# Altium project LED_Nixie_Display.PrjPcb
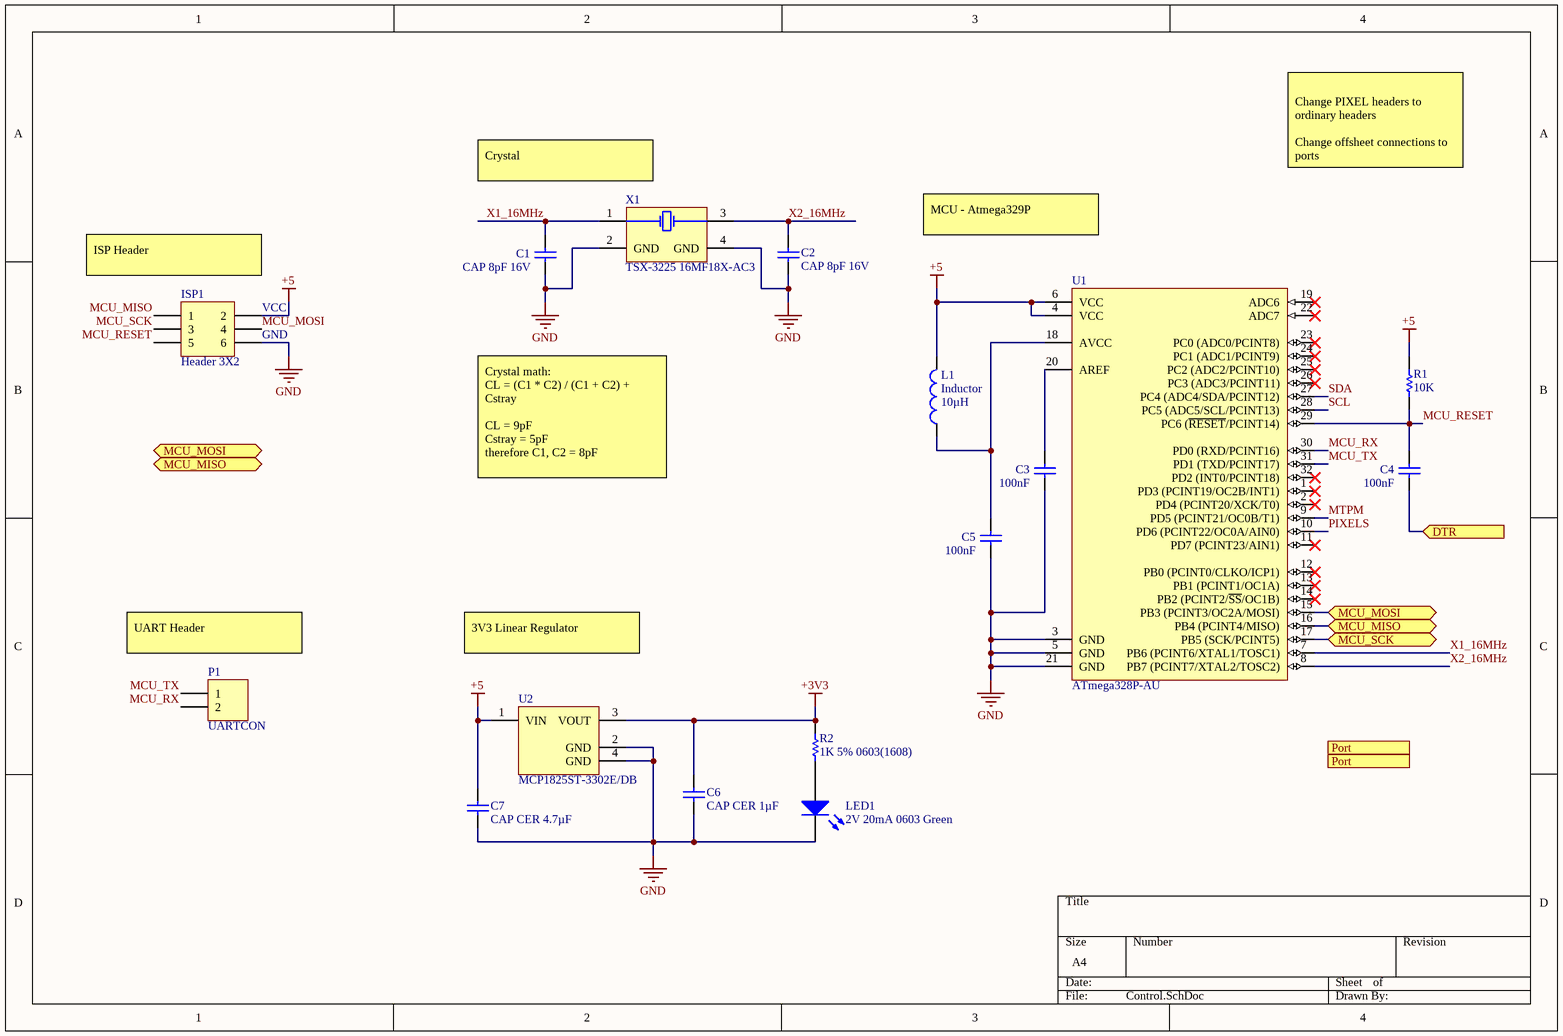
[diagram p0: Control.SchDoc]
5 sheets, 67 parts. Net scope: flat (ports and power ports of the same name join across sheets).
Board files: MasterBoard.PcbDoc, PCB1.PcbDoc
Sheets:
  Control.SchDoc
  LEDs.SchDoc
  RTC.SchDoc
  USB.SchDoc
  Touch.SchDoc

## Sheet Control.SchDoc
size A4

### Parts
C1  CAP 8pF 16V  [CAPC0603(1608)100_N]
C2  CAP 8pF 16V  [CAPC0603(1608)100_N]
C3  100nF  [CAPC0603(1608)100_M]
C4  100nF  [CAPC0603(1608)100_M]
C5  100nF  [CAPC0603(1608)100_M]
C6  CAP CER 1µF  [CAPC1608X90X20LL10]
C7  CAP CER 4.7µF  [CAPC1608X90X35NL10T15]
ISP1  Header 3X2  [HDR2X3]
L1  Inductor  value 10µH  [0603]
LED1  2V 20mA 0603 Green  [0603_A]
P1  UARTCON  [HDR1X2]
R1  10K  [RESC0603(1608)_N]
R2  1K 5% 0603(1608)  [RESC0603(1608)_L]
U1  ATmega328P-AU  [32A_M]
U2  MCP1825ST-3302E/DB  [SOT-223-DB3_L]
X1  TSX-3225 16MF18X-AC3  [EPSON-TSX-3225_V]

### Ports
DTR (in), MCU_MISO (bidir), MCU_MOSI (bidir), MCU_SCK (bidir), Port

### Nets
+3V3: C6.2 R2.2 U2.3(VOUT)
+5: C7.2 ISP1.2 L1.2 R1.2 U1.4(VCC) U1.6(VCC) U2.1(VIN)
GND: C1.1 C2.2 C3.1 C5.1 C6.1 C7.1 ISP1.6 LED1.1(K) U1.3(GND) U1.5(GND) U1.21(GND) U2.2(GND) U2.4(GND) X1.2(GND) X1.4(GND)
MCU_MISO: ISP1.1
MCU_MOSI: ISP1.4
MCU_RESET: C4.2 ISP1.5 R1.1 U1.29(PC6_(~{RESET}/PCINT14))
MCU_RX: P1.2 U1.30(PD0_(RXD/PCINT16))
MCU_SCK: ISP1.3
MCU_TX: P1.1 U1.31(PD1_(TXD/PCINT17))
MTPM: U1.9(PD5_(PCINT21/OC0B/T1))
PIXELS: U1.10(PD6_(PCINT22/OC0A/AIN0))
SCL: U1.28(PC5_(ADC5/SCL/PCINT13))
SDA: U1.27(PC4_(ADC4/SDA/PCINT12))
X1_16MHz: C1.2 U1.7(PB6_(PCINT6/XTAL1/TOSC1)) X1.1(X1)
X2_16MHz: C2.1 U1.8(PB7_(PCINT7/XTAL2/TOSC2)) X1.3(X2)
NetC3_2: C3.2 U1.20(AREF)
NetC4_1: C4.1 ; port DTR
NetC5_2: C5.2 L1.1 U1.18(AVCC)
NetLED1_2: LED1.2(A) R2.1
NetU1_15: U1.15(PB3_(PCINT3/OC2A/MOSI)) ; port MCU_MOSI
NetU1_16: U1.16(PB4_(PCINT4/MISO)) ; port MCU_MISO
NetU1_17: U1.17(PB5_(SCK/PCINT5)) ; port MCU_SCK

Not connected (* = marked no-connect by the designer): U1 1(PD3_(PCINT19/OC2B/INT1))* 2(PD4_(PCINT20/XCK/T0))* 11(PD7_(PCINT23/AIN1))* 12(PB0_(PCINT0/CLKO/ICP1))* 13(PB1_(PCINT1/OC1A))* 14(PB2_(PCINT2/~{SS}/OC1B))* 19(ADC6)* 22(ADC7)* 23(PC0_(ADC0/PCINT8))* 24(PC1_(ADC1/PCINT9))* 25(PC2_(ADC2/PCINT10))* 26(PC3_(ADC3/PCINT11))* 32(PD2_(INT0/PCINT18))*

### Notes on the sheet
- (near X1) Crystal
- Change PIXEL headers to ordinary headers
  Change offsheet connections to ports
- MCU - Atmega329P
- (near ISP1) ISP Header
- (near ISP1) VCC
- (near ISP1) GND
- Crystal math:
  CL = (C1 * C2) / (C1 + C2) + Cstray
  CL = 9pF
  Cstray = 5pF
  therefore C1, C2 = 8pF
- (near P1) UART Header
- 3V3 Linear Regulator

### Library data of the parts
C1 C2 = CMP-1035-00808-1: CAP 22pF 16V ±5% 0603 (1608 Metric) Thickness 1mm SMD; Tolerance: Â±5%; Case-EIA: 0603; Case-Metric: 1608; Technology: SMT; Value: 22pF; Rated Voltage: 16 V; Max Thickness: 1 mm
C3-C5 = CMP-1035-02583-1: CAP 100nF 16V ±5% 0603 (1608 Metric) Thickness 1mm SMD; Tolerance: Â±5%; Case-Metric: 1608; Case-EIA: 0603; Rated Voltage: 16 V; Max Thickness: 1 mm; Technology: SMT; Value: 100nF
C6 = CMP-2000-06025-1: Chip Capacitor, 1 uF, +/- 10%, 50 V, -55 to 85 degC, 0603 (1608 Metric), RoHS, Tape and Reel / C1608X5R1H105K080AB; Manufacturer: TDK; PCN Part Number: MLCCPartNumberChange30/Nov/2012; Other Names: 445-7468-6; Online Catalog: CSeries,GeneralPurpose; Product Training Modules: CSeriesGeneralApplicationsSEAT,CCV,andTVCLDesignToolsGuidetoReplacinganElectrolyticCapacitorwithanMLCC; Voltage - Rated: 50V; Design Resources: 20WNon-IsolatedBuckLEDDriverUsingPLLNK460KG; Temperature Coefficient: X5R; Series: C; Datasheet Version: 08/2016; Package Description: 2-Pin Surface Mount Device, Body 1.6 x 0.8 mm; Mounting Technology: SurfaceMount; Capacitance: 1µF; Features: -; Size / Dimension: 0.063"Lx0.031"W(1.60mmx0.80mm); Lead Spacing: -; Operating Temperature: -55°C~85°C; Tolerance: ±10%; Height - Seated (Max): -; Mounting Type: SurfaceMount,MLCC; Ratings: -; Standard Package: 1; Applications: GeneralPurpose; Datasheet URL: https://product.tdk.com/info/en/catalog/datasheets/mlcc_commercial_general_en.pdf; Category: Capacitors; Lead Style: -; Packaging: Digi-Reel®; RoHS Information: RoHSCertificate-MLCC; Package / Case: 0603(1608Metric); Package Reference: 0603; Manufacturer URL: http://www.tdk.com/; Thickness (Max): 0.035"(0.90mm); Family: CeramicCapacitors
C7 = CMP-2006-02523-1: GRM188R61E475KE11D; Manufacturer: Murata; Part Number: GRM188R61E475KE11D
ISP1 = Header 3X2: Header, 3-Pin, Dual row; LatestRevisionDate: 17-Jul-2002; LatestRevisionNote: Re-released for DXP Platform.; Publisher: Altium Limited
L1 = Inductor: Code_IEC: 1005; Published: 8-Jun-2000; LatestRevisionDate: 29-May-2009; LatestRevisionNote: IPC-7351 Footprint Added.; PackageReference: 0402-A; Publisher: Altium Limited; PackageDescription: Chip Inductor; Code_JEITA: 0402
LED1 = CMP-1426-00001-1: SMD mono-color Chip LED, WL-SMCW, Red; Manufacturer: Wuerth Elektronik; PartNumber: 150060RS75000; Color: Red; PackageReference: 0603_A; ComponentLink2URL: http://katalog.we-online.com/led/datasheet/150060RS75000.pdf; ComponentLink1URL: http://www.we-online.com; ComponentLink1Description: Manufacturer URL; ComponentLink2Description: Datasheet
P1 = Header 2: Header, 2-Pin; LatestRevisionDate: 17-Jul-2002; LatestRevisionNote: Re-released for DXP Platform.; Publisher: Altium Limited
R1 = CMP-1012-00098-1: 10K 0.1W 5% 0603 (1608 Metric)  SMD; Case-EIA: 0603; Value: 10000.00 Ohm; Case-Metric: 1608; Technology: SMT; Tolerance: 5 %; Power: 0.1 W
R2 = CMP-1012-00074-1: 1K 0.1W 5% 0603 (1608 Metric)  SMD; Case-EIA: 0603; Case-Metric: 1608; Value: 1000.00 Ohm; Technology: SMT; Tolerance: 5 %; Power: 0.1 W
U1 = CMP-0095-00269-2: 8-bit AVR Microcontroller, 32KB Flash, 1KB EEPROM, 2KB SRAM, 32-pin TQFP, Industrial Grade (-40°C to 85°C); PackageDescription: 32-Lead, 7x7x1.0 mm Body, 0.8mm Lead Pitch, Thin Profile Plastic Quad Flat Package (TQFP); DatasheetVersion: revD, May-2011; RevisionNote: DatasheetVersion & PackageVersion updated. URLs added.; ComponentLink1URL: http://www.atmel.com/; ComponentLink2Description: ATmega48A/48PA/88A/88PA/168A/168PA/328/328P Datasheet; Code_JEDEC: MS-026-ABA; ComponentLink1Description: Manufacturer URL; PackageReference: 32A; ComponentLink3Description: ATmega48A/48PA/88A/88PA/168A/168PA/328/328P Summary; ComponentLink2URL: http://www.atmel.com/dyn/resources/prod_documents/doc8271.pdf; PackageVersion: revC, Oct-2010; ComponentLink3URL: http://www.atmel.com/dyn/resources/prod_documents/8271S.pdf
U2 = CMP-0136-00486-1: 500 mA, Low Voltage, Low Quiescent Current LDO Regulator, 3-Pin SOT-223, Extended Temperature, Tape and Reel; DatasheetVersion: revB, Feb-2008; PackageReference: SOT-223-DB3; PackageVersion: revBB, Aug-2009; PackageDescription: 3-Lead Plastic Small Outline Transistor (DB) [SOT-223]
X1 = CMP-2000-07332-1: MHz Range Crystal Unit, 16 MHz, -40 to 85 degC, 4-Pin SMD, RoHS, Tape and Reel; Manufacturer: Epson; Unit Weight: 0.000564oz; Tolerance: 10PPM; ESR: 60Ohms; Frequency: 16MHz; Drive Level: 200uW; Brand: EpsonTiming; Load Capacitance: 9pF; Product Category: Crystals; Packaging: Reel; Termination Style: SMD/SMT; Width: 2.5mm; Length: 3.2mm; Type: Crystal; Datasheet Version: 12/2015; Factory Pack Quantity: 250; Package Description: 4-Pin Surface Mount Device, Body 3.2 x 2.5 mm; Package / Case: 3.2mmx2.5mm; Mounting Style: SMD/SMT; Series: TSX-3225; Frequency Stability: 10PPM; Package Reference: TSX-3225; Mounting Technology: SurfaceMount; RoHS: True; Height: 0.6mm; Datasheet URL: https://support.epson.biz/td/api/doc_check.php?dl=brief_FA-238V_en.pdf; Operating Temperature Range: -40Cto+85C; Manufacturer URL: https://www.eea.epson.com/

## Sheet LEDs.SchDoc
size A4 portrait
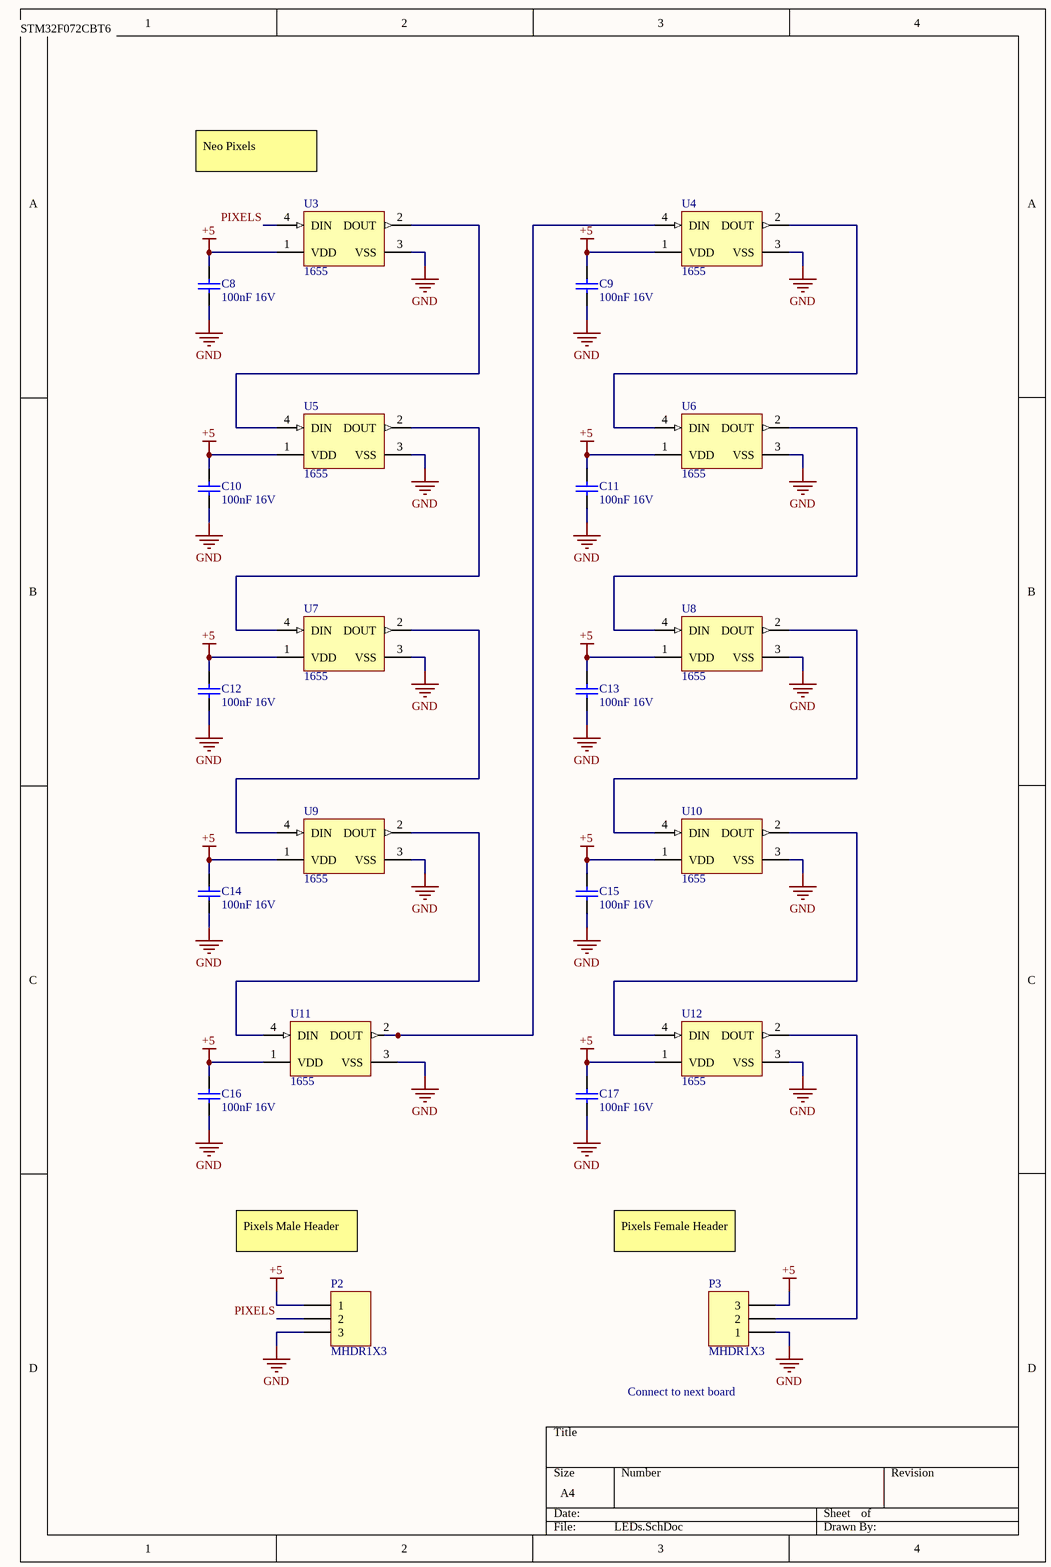
[diagram p1: LEDs.SchDoc]

### Parts
C8  100nF 16V  [CAPC0603(1608)100_N]
C9  100nF 16V  [CAPC0603(1608)100_N]
C10  100nF 16V  [CAPC0603(1608)100_N]
C11  100nF 16V  [CAPC0603(1608)100_N]
C12  100nF 16V  [CAPC0603(1608)100_N]
C13  100nF 16V  [CAPC0603(1608)100_N]
C14  100nF 16V  [CAPC0603(1608)100_N]
C15  100nF 16V  [CAPC0603(1608)100_N]
C16  100nF 16V  [CAPC0603(1608)100_N]
C17  100nF 16V  [CAPC0603(1608)100_N]
P2  MHDR1X3  [MHDR1X3]
P3  MHDR1X3  [MHDR1X3]
U3  1655  [ADA-RGB-1655_V]
U4  1655  [ADA-RGB-1655_V]
U5  1655  [ADA-RGB-1655_V]
U6  1655  [ADA-RGB-1655_V]
U7  1655  [ADA-RGB-1655_V]
U8  1655  [ADA-RGB-1655_V]
U9  1655  [ADA-RGB-1655_V]
U10  1655  [ADA-RGB-1655_V]
U11  1655  [ADA-RGB-1655_V]
U12  1655  [ADA-RGB-1655_V]

### Nets
+5: C8.2 C9.2 C10.2 C11.2 C12.2 C13.2 C14.2 C15.2 C16.2 C17.2 P2.1 P3.3 U3.1(VDD) U4.1(VDD) U5.1(VDD) U6.1(VDD) U7.1(VDD) U8.1(VDD) U9.1(VDD) U10.1(VDD) U11.1(VDD) U12.1(VDD)
GND: C8.1 C9.1 C10.1 C11.1 C12.1 C13.1 C14.1 C15.1 C16.1 C17.1 P2.3 P3.1 U3.3(VSS) U4.3(VSS) U5.3(VSS) U6.3(VSS) U7.3(VSS) U8.3(VSS) U9.3(VSS) U10.3(VSS) U11.3(VSS) U12.3(VSS)
PIXELS: P2.2 U3.4(DIN)
NetP3_2: P3.2 U12.2(DOUT)
NetU3_2: U3.2(DOUT) U5.4(DIN)
NetU4_2: U4.2(DOUT) U6.4(DIN)
NetU4_4: U4.4(DIN) U11.2(DOUT)
NetU5_2: U5.2(DOUT) U7.4(DIN)
NetU6_2: U6.2(DOUT) U8.4(DIN)
NetU7_2: U7.2(DOUT) U9.4(DIN)
NetU8_2: U8.2(DOUT) U10.4(DIN)
NetU9_2: U9.2(DOUT) U11.4(DIN)
NetU10_2: U10.2(DOUT) U12.4(DIN)

### Notes on the sheet
- STM32F072CBT6
- Neo Pixels
- Pixels Male Header
- Pixels Female Header
- Connect to next board

### Library data of the parts
C8-C17 = CMP-1035-02584-1: CAP 100nF 16V ±10% 0603 (1608 Metric) Thickness 1mm SMD; Tolerance: Â±10%; Case-EIA: 0603; Case-Metric: 1608; Technology: SMT; Max Thickness: 1 mm; Value: 100nF; Rated Voltage: 16 V
P2 P3 = MHDR1X3: Header, 3-Pin; LatestRevisionDate: 17-Jul-2002; LatestRevisionNote: Re-released for DXP Platform.; Publisher: Altium Limited
U3-U12 = CMP-2000-05026-1: Intelligent Control LED Integrated Light Source, 3.5 to 5.3 V, -25 to 80 degC, 4-Pin SMD, RoHS, Tape and Reel; Manufacturer: Adafruit-Industries-LLC; Number of LEDs: 10; Configuration: Discrete; Utilized LED: WS2812(5050); Datasheet URL: http://datasheet.octopart.com/ADA1655-Adafruit-Industries-datasheet-32028139.pdf; Series: Neopixel; Interface: -; Package Description: 4-Pin Surface Mount Device, Body 5 x 5 mm; Color: Red,Green,Blue(RGB); Category: Optoelectronics; Controller Type: -; Package Reference: 1655; Manufacturer URL: https://www.adafruit.com/; Mounting Type: SurfaceMount; Datasheet Version: May-13; Size / Dimension: 5.00mmLx5.00mmW; Family: Addressable,Specialty

## Sheet RTC.SchDoc
size A4
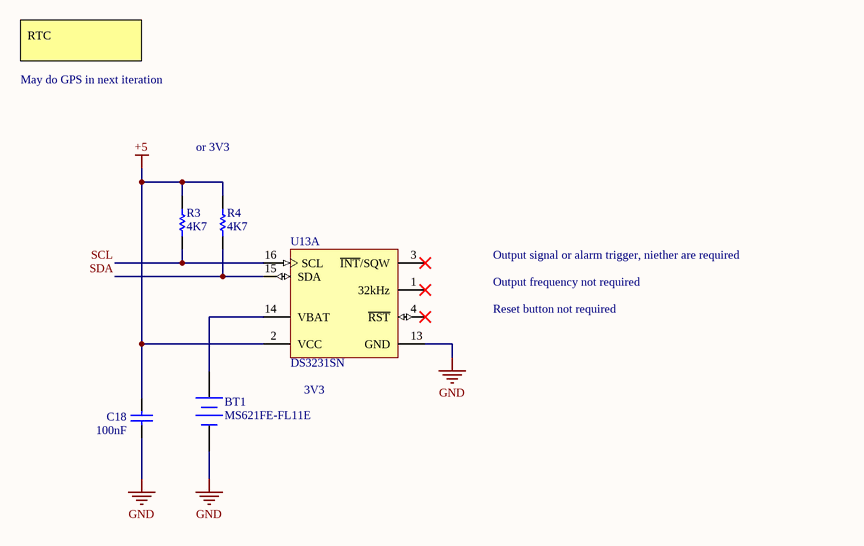
[diagram p2: RTC.SchDoc]

### Parts
BT1  MS621FE-FL11E  [SEIK-MS621FE-FL11E-2_V]
C18  100nF  [CAPC0603(1608)100_M]
R3  4K7  [RESC0603(1608)_N]
R4  4K7  [RESC0603(1608)_N]
U13  DS3231SN  [W16-H2_L]  (part A of 2)

### Nets
+5: C18.2 R3.1 R4.2 U13.2(VCC)
GND: BT1.2(-) C18.1 U13.13(GND)
SCL: R3.2 U13.16(SCL)
SDA: R4.1 U13.15(SDA)
NetBT1_1: BT1.1(+) U13.14(VBAT)

Not connected (* = marked no-connect by the designer): U13 1(32kHz)* 3(~{INT}/SQW)* 4(~{RST})*

### Notes on the sheet
- RTC
- May do GPS in next iteration
- or 3V3
- Output signal or alarm trigger, niether are required
- Output frequency not required
- Reset button not required
- (near U13) 3V3

### Library data of the parts
BT1 = CMP-2000-05342-1: MS Lihium Rechargeable Battery, 3 V, -20 to 60 degC, Tray; Manufacturer: SeikoInstruments; Brand: SeikoInstrumentsMicroEnergy; Output Voltage: 3V; Capacity: 5.5mAh; Chemistry: Lithium; Battery Size: 621; Unit Weight: 0.008113oz; Datasheet URL: http://datasheet.octopart.com/MS621FE-FL11E-Seiko-datasheet-5320152.pdf; Rechargeable/Non-Rechargeable: Rechargeable; Orientation: Vertical; Height: 2.1mm; Series: MS; Datasheet Version: Jan-08; Type: CoinCellBatterywithLeads; Diameter: 6.8mm; Mounting Style: WithLeads; Product Category: CoinCellBattery; Termination Style: ThroughHole; Packaging: Tray; Manufacturer URL: http://www.sii.co.jp/en/; RoHS: NotApplicable; Factory Pack Quantity: 100
C18 = CMP-1035-02583-1: as C3 on sheet Control; Rated Voltage: 16 V; Max Thickness: 1 mm; Technology: SMT; Value: 100nF
R3 R4 = CMP-1012-00090-1: 4K7 0.1W 5% 0603 (1608 Metric)  SMD; Case-Metric: 1608; Value: 4700.00 Ohm; Case-EIA: 0603; Tolerance: 5 %; Technology: SMT; Power: 0.1 W
U13 = CMP-0254-00293-1: Extremely Accurate I2C-Integrated Real-Time Clock/TCXO/Crystal, 16-Pin SO, -40 to 85 degC; ComponentLink1Description: Manufacturer URL; ComponentLink3URL: http://pdfserv.maxim-ic.com/package_dwgs/21-0042.PDF; ComponentLink3Description: Package Specification; PackageVersion: revD, 2010; ComponentLink2URL: http://datasheets.maxim-ic.com/en/ds/DS3231.pdf; ComponentLink2Description: Datasheet; PackageReference: W16-H2; Code_JEDEC: MS-013-AA; ComponentLink1URL: http://www.maxim-ic.com; PackageDescription: 16-Pin Small-Outline IC, Wide (0.3in), 1.27 mm Pitch, SOIC (W); Code_IPC: SOIC127P1030-16; DatasheetVersion: Rev 8, Jul-2010

## Sheet USB.SchDoc
size A4
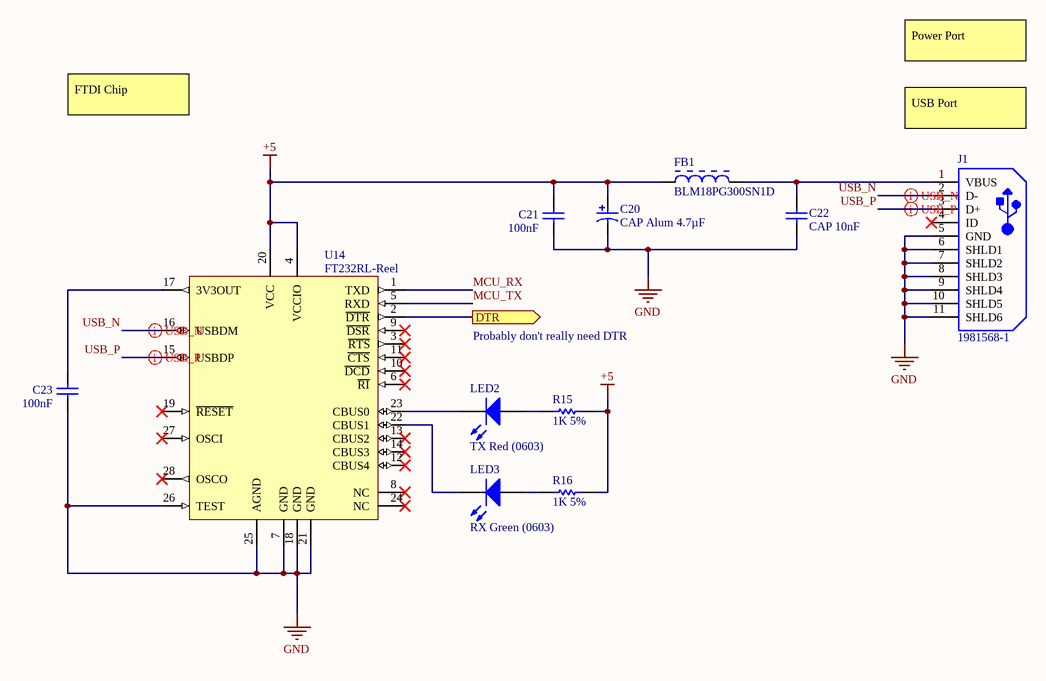
[diagram p3: USB.SchDoc]

### Parts
C20  CAP Alum 4.7µF  [NIC-CAPA2-4X5.8_V]
C21  100nF  [CAPC0603(1608)100_M]
C22  CAP 10nF  [CAPC0603(1608)100_M]
C23  100nF  [CAPC0603(1608)100_M]
FB1  BLM18PG300SN1D  [MURA-BLM18PG_KG-CHIP-2_V1]
J1  1981568-1  [TECO-1981568-5_V]
LED2  TX Red (0603)  [0603_A]
LED3  RX Green (0603)  [LITE-ON-LTST-C191KRKT-2_V]
R15  1K 5%  [RESC0603(1608)_L]
R16  1K 5%  [RESC0603(1608)_L]
U14  FT232RL-Reel  [SSOP-28_L]

### Ports
DTR (out)

### Nets
+5: C20.1 C21.2 FB1.1 R15.1 R16.1 U14.4(VCCIO) U14.20(VCC)
GND: C20.2 C21.1 C22.1 C23.1 J1.5(GND) J1.6(SHLD1) J1.7(SHLD2) J1.8(SHLD3) J1.9(SHLD4) J1.10(SHLD5) J1.11(SHLD6) U14.7(GND) U14.18(GND) U14.21(GND) U14.25(AGND) U14.26(TEST)
MCU_RX: U14.1(TXD)
MCU_TX: U14.5(RXD)
USB_N: J1.2(D-) U14.16(USBDM)
USB_P: J1.3(D+) U14.15(USBDP)
NetC4_1: U14.2(~{DTR}) ; port DTR
NetC22_2: C22.2 FB1.2 J1.1(VBUS)
NetC23_2: C23.2 U14.17(3V3OUT)
NetLED2_1: LED2.1(K) U14.23(CBUS0)
NetLED2_2: LED2.2(A) R15.2
NetLED3_1: LED3.1(A) R16.2
NetLED3_2: LED3.2(K) U14.22(CBUS1)

Not connected (* = marked no-connect by the designer): J1 4(ID)*; U14 3(~{RTS})* 6(~{RI})* 8(NC)* 9(~{DSR})* 10(~{DCD})* 11(~{CTS})* 12(CBUS4)* 13(CBUS2)* 14(CBUS3)* 19(~{RESET})* 24(NC)* 27(OSCI)* 28(OSCO)*

### Layout directives
differential pair; differential pair class USB_N; rule Differential Pairs Routing [Pref Gap = 10mil    Min Gap  = 10mil    Max Gap  = 10milPref Width = 15mil    Min Width  = 15mil    Max Width  = 15mil]: USB_N
differential pair; differential pair class USB_P; rule Differential Pairs Routing [Pref Gap = 10mil    Min Gap  = 10mil    Max Gap  = 10milPref Width = 15mil    Min Width  = 15mil    Max Width  = 15mil]: USB_P

### Notes on the sheet
- Power Port
- FTDI Chip
- USB Port
- Probably don't really need DTR

### Library data of the parts
C20 = CMP-0687-00013-1: Aluminum Electrolytic Capacitor, UD Series, Low Impedance, 4.7 uF, 35 V, + / - 20%, -55 to 105 degC, Chip Type, 4 x 5.8 mm D x L, Pb-Free, Reel / UUD1V4R7MCL1GS; Manufacturer: Nichicon; Rated Voltage: 35 V; Packing: Dia382mm Reel; Rated Ripple Current (at 100kHz): 80 mA; Rated Capacitance: 4.7 uF; Impedance: 1.8 Ohm; Endurance Time: 2000 h; Tolerance Rated Capacitance: -20 to 20%; Diameter: 4 mm; Length: 5.8 mm; ComponentLink2Description: Datasheet; DatasheetVersion: 08/2012; Mounting Technology: Surface Mount; PackageDescription: 2-Pin Surface Mount Device, Diameter 4 mm, Height 5.8 mm, Pitch 3.6 mm; ComponentLink2URL: http://products.nichicon.co.jp/en/pdf/XJA043/e-ud.pdf; ComponentLink1Description: Manufacturer URL; PackageReference: CAPAE-D4H5.8; ComponentLink3Description: Package Specification; RoHS: TRUE; ComponentLink1URL: http://www.nichicon.co.jp/; PartNumber: UUD1V4R7MCL1GS; ComponentLink3URL: http://products.nichicon.co.jp/en/pdf/XJA043/e-ud.pdf
C21 C23 = CMP-1035-02583-1: as C3 on sheet Control; Rated Voltage: 16 V; Max Thickness: 1 mm; Technology: SMT; Value: 100nF
C22 = CMP-1035-02306-1: CAP 10nF 10V ±10% 0603 (1608 Metric) Thickness 1mm SMD; Tolerance: Â±10%; Case-EIA: 0603; Case-Metric: 1608; Rated Voltage: 10 V; Value: 10nF; Technology: SMT; Max Thickness: 1 mm
FB1 = CMP-0686-00572-2: Chip Ferrite Bead for Power Lines, 30 Ohm, 1000 mA, -55 to 125 degC, 1.6 x 0.8 x 0.95 mm SMD, Tape and Reel; Manufacturer: Murata; DC Resistance: 0.05 Ohm Max.; Impedance (at 100 MHz): 30 Ohm Typ.; Rated Current: 1000 mA; ComponentLink1Description: Manufacturer URL; Packing: Tape and Reel; ComponentLink2URL: http://www.murata.com/products/catalog/pdf/c31e.pdf; DatasheetVersion: 08/2013; PartNumber: BLM18PG300SN1D; Mounting Technology: Surface Mount; ComponentLink2Description: Datasheet; PackageReference: BLM18_H950-2; Operating Temperature Range: -55 to 125 degC; ComponentLink3Description: Package Specification; PackageDescription: 2-Pin Chip, Body 1.6 x 0.8 mm; ComponentLink1URL: http://www.murata.com/; ComponentLink3URL: http://www.murata.com/products/catalog/pdf/c31e.pdf
J1 = CMP-2000-05408-1: Micro USB Receptacle Standard Type B Assy, 5-Pin SMD, RoHS, Tape and Reel; Manufacturer: TE Connectivity; Body Orientation: RightAngle; Number of Ports: 1Port; Number of Contacts: 5POS; Gender: RCP; Voltage Rating Max: 30VAC; Product Depth (mm): 5.6mm; Pitch (mm): 0.65mm; Current Rating (Max): 1/ContactA; Product Length (mm): 8mm; Product Height (mm): 3mm; Operating Temperature Max Deg. C: 85C; Datasheet URL: http://www.mouser.com/ds/2/418/NG_CD_1981568_E2-621296.pdf; Termination Method: Solder; Number of Terminals: 5; Operating Temp Range: -55Cto85C; Mounting Style: SurfaceMount; Manufacturer URL: http://www.te.com/; Contact Material: CopperAlloy; Packaging: TapeandReel; Datasheet Version: Rev. E2, 08/2015; Operating Temperature Min Deg. C: -55C; Housing Material: Thermoplastic; Type: MicroUSB; Contact Plating: GoldOverNickel
LED2 = CMP-1426-00001-1: as LED1 on sheet Control; Color: Red; PackageReference: 0603_A; ComponentLink2URL: http://katalog.we-online.com/led/datasheet/150060RS75000.pdf; ComponentLink1URL: http://www.we-online.com; ComponentLink1Description: Manufacturer URL; ComponentLink2Description: Datasheet
LED3 = CMP-2000-05198-1: Chip LED, Green, 574 nm, 40 pF, -55 to 85 degC, 2-Pin SMD, RoHS, Tape and Reel; Manufacturer: Lite-On; Rad Hardened: No; Emitting Color: YellowGreen; Product Height (mm): 0.55mm; Forward Voltage: 2.4V; Number of Elements: 1; Dominant Wave Length: 571nm; DELETED: Compliant; Viewing Angle: 130deg; High Brightness: Yes; Peak Wavelength: 574nm; Type: Uni-Color; Forward Current: 30mA; Product Length (mm): 1.6mm; Luminous Intensity: 35mcd; Test Current (It): 20mA; Chip Material: AlGaInP; Product Depth (mm): 0.8mm; Shape Type: Rectangular; Reverse Voltage: 5V; Power Dissipation: 75W; Pin Count: 2; Lens Dimensions: 1.1X0.8X0.37mm; Packaging: TapeandReel; Main Category: ChipLED; Operating Temperature Classification: Industrial; Package Type: ChipLed; Mounting: SurfaceMount; Lum Intensity: 35mcd; Operating Temp Range: -55Cto85C; Datasheet Version: Jan-07; Datasheet URL: http://download.siliconexpert.com/pdfs/2007/08/26/semi_b/manual/lot/ds/ltst-c191kgkt.pdf; Manufacturer URL: http://www.us.liteon.com/
R15 R16 = CMP-1012-00074-1: as R2 on sheet Control; Technology: SMT; Tolerance: 5 %; Power: 0.1 W
U14 = CMP-0078-00029-3: USB UART Asynchronous Serial Data Transfer Chip, 28-pin SSOP, Tape and Reel; Manufacturer: FTDI; PackageVersion: Mar-12; PackageReference: SSOP-28; ComponentLink2Description: Datasheet; DatasheetVersion: ver 2.10, Mar-2012; PackageDescription: 28-Pin Small Outline Package 0.65 mm Pitch; ComponentLink1Description: Manufacturer URL; RevisionNote: DatasheetVersion updated to 2.10 Mar-2012; PartNumber: FT232RL-Reel; ComponentLink1URL: http://www.ftdichip.com/; ComponentLink2URL: http://www.ftdichip.com/Support/Documents/DataSheets/ICs/DS_FT232R.pdf

## Sheet Touch.SchDoc
size A4
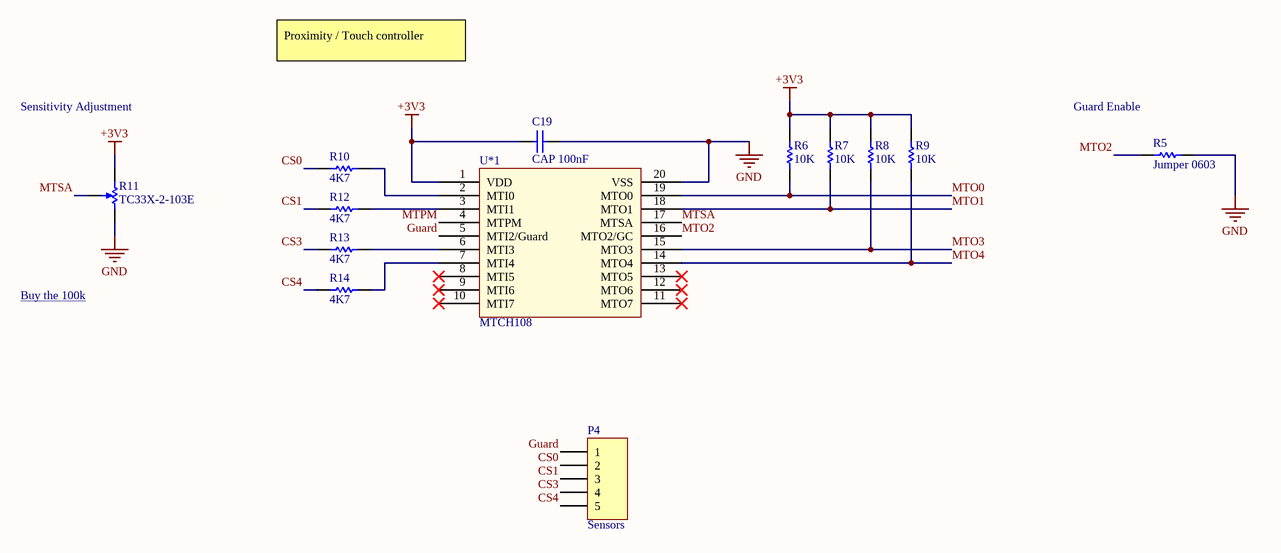
[diagram p4: Touch.SchDoc]

### Parts
C19  CAP 100nF  [CAPC0603(1608)100_M]
P4  Sensors  [HDR1X5]
R5  Jumper 0603  [RESC0603(1608)_N]
R6  10K  [RESC0603(1608)_N]
R7  10K  [RESC0603(1608)_N]
R8  10K  [RESC0603(1608)_N]
R9  10K  [RESC0603(1608)_N]
R10  4K7  [RESC0603(1608)_N]
R11  TC33X-2-103E  [BOUR-TC33X-2_V]
R12  4K7  [RESC0603(1608)_N]
R13  4K7  [RESC0603(1608)_N]
R14  4K7  [RESC0603(1608)_N]
U*1  MTCH108  [MTCH-108 SSOP]

### Nets
+3V3: C19.2 R6.2 R7.2 R8.2 R9.2 R11.1 U*1.1(VDD)
GND: C19.1 R5.2 R11.3 U*1.20(VSS)
CS0: P4.2 R10.1
CS1: P4.3 R12.1
CS3: P4.4 R13.1
CS4: P4.5 R14.1
Guard: P4.1 U*1.5(MTI2/Guard)
MTO0: R6.1 U*1.19(MTO0)
MTO1: R7.1 U*1.18(MTO1)
MTO2: R5.1 U*1.16(MTO2/GC)
MTO3: R8.1 U*1.15(MTO3)
MTO4: R9.1 U*1.14(MTO4)
MTPM: U*1.4(MTPM)
MTSA: R11.2 U*1.17(MTSA)
NetR10_2: R10.2 U*1.2(MTI0)
NetR12_2: R12.2 U*1.3(MTI1)
NetR13_2: R13.2 U*1.6(MTI3)
NetR14_2: R14.2 U*1.7(MTI4)

Not connected (* = marked no-connect by the designer): U*1 8(MTI5)* 9(MTI6)* 10(MTI7)* 11(MTO7)* 12(MTO6)* 13(MTO5)*

### Notes on the sheet
- Proximity / Touch controller
- Sensitivity Adjustment
- (near R5) Guard Enable
- Buy the 100k <https://www.digikey.com.au/product-detail/en/bourns-inc/TC33X-2-104E/TC33X-104ETR-ND/612859>

### Library data of the parts
C19 = CMP-1035-02583-1: as C3 on sheet Control; Rated Voltage: 16 V; Max Thickness: 1 mm; Technology: SMT; Value: 100nF
P4 = Header 5: Header, 5-Pin; LatestRevisionDate: 17-Jul-2002; LatestRevisionNote: Re-released for DXP Platform.; Publisher: Altium Limited
R5 = CMP-1012-00001-1: Jumper 0603 (1608 Metric); Case-Metric: 1608; Value: 0.00 Ohm; Power: None; Case-EIA: 0603; Technology: SMT; Tolerance: None
R6-R9 = CMP-1012-00098-1: as R1 on sheet Control; Technology: SMT; Tolerance: 5 %; Power: 0.1 W
R10 R12-R14 = CMP-1012-00090-1: as R3 on sheet RTC; Tolerance: 5 %; Technology: SMT; Power: 0.1 W
R11 = CMP-2100-03695-1: Trimming Potentiometer, 10000 Ohm, -40 to 100 degC, 3-Pin SMD, RoHS, Tape and Reel; Manufacturer: Bourns; Tolerance: 25%; Max Power Dissipation: 100mW; Number of Turns: 1; Resistance: 10KOhm; Temperature Coefficient: 250ppm/degreesC; Voltage Rating (DC): 50V; Datasheet URL: http://www.bourns.com/docs/Product-Datasheets/TC33.pdf; Composition: Potentiometer; Package Description: 3-Pin Surface Mount Device, Body 3.8 x 3.6 mm; Weight: 29.4mg; Power Rating: 100mW; Termination: FootPrint; Manufacturer URL: http://www.bourns.com/; Width: 0.118inch; Height: 0.047inch; Military Standard: Not; Radiation Hardening: No; Colour: Silver; Case/Package: SMD/SMT; Depth: 3.8mm; Min Operating Temperature: -40degC; Lead Free: LeadFree; Datasheet Version: 42583.0; REACH SVHC: NoSVHC; Length: 3mm; RoHSCompliant: true; Contact Plating: Silver; Taper: Linear; Packaging: TapeandReel; Mount: SurfaceMount; Max Operating Temperature: 100degC; Package Reference: TC33X-2; Package Quantity: 2500
U*1 = MTCH108: ComponentLink1Description: Datasheet; ComponentLink1URL: http://ww1.microchip.com/downloads/en/DeviceDoc/40001793C.pdf

## Nets that join several sheets
+3V3: Control (C6.2 R2.2 U2.3), Touch (7 pins)
+5: Control (7 pins), LEDs (22 pins), RTC (C18.2 R3.1 R4.2 U13.2), USB (7 pins)
GND: Control (15 pins), LEDs (22 pins), RTC (BT1.2 C18.1 U13.13), USB (16 pins), Touch (C19.1 R5.2 R11.3 U*1.20)
NetC4_1: Control (C4.1), USB (U14.2)